# EAGLE design LoRa-E5-Sensor (EAGLE 9.6.2)
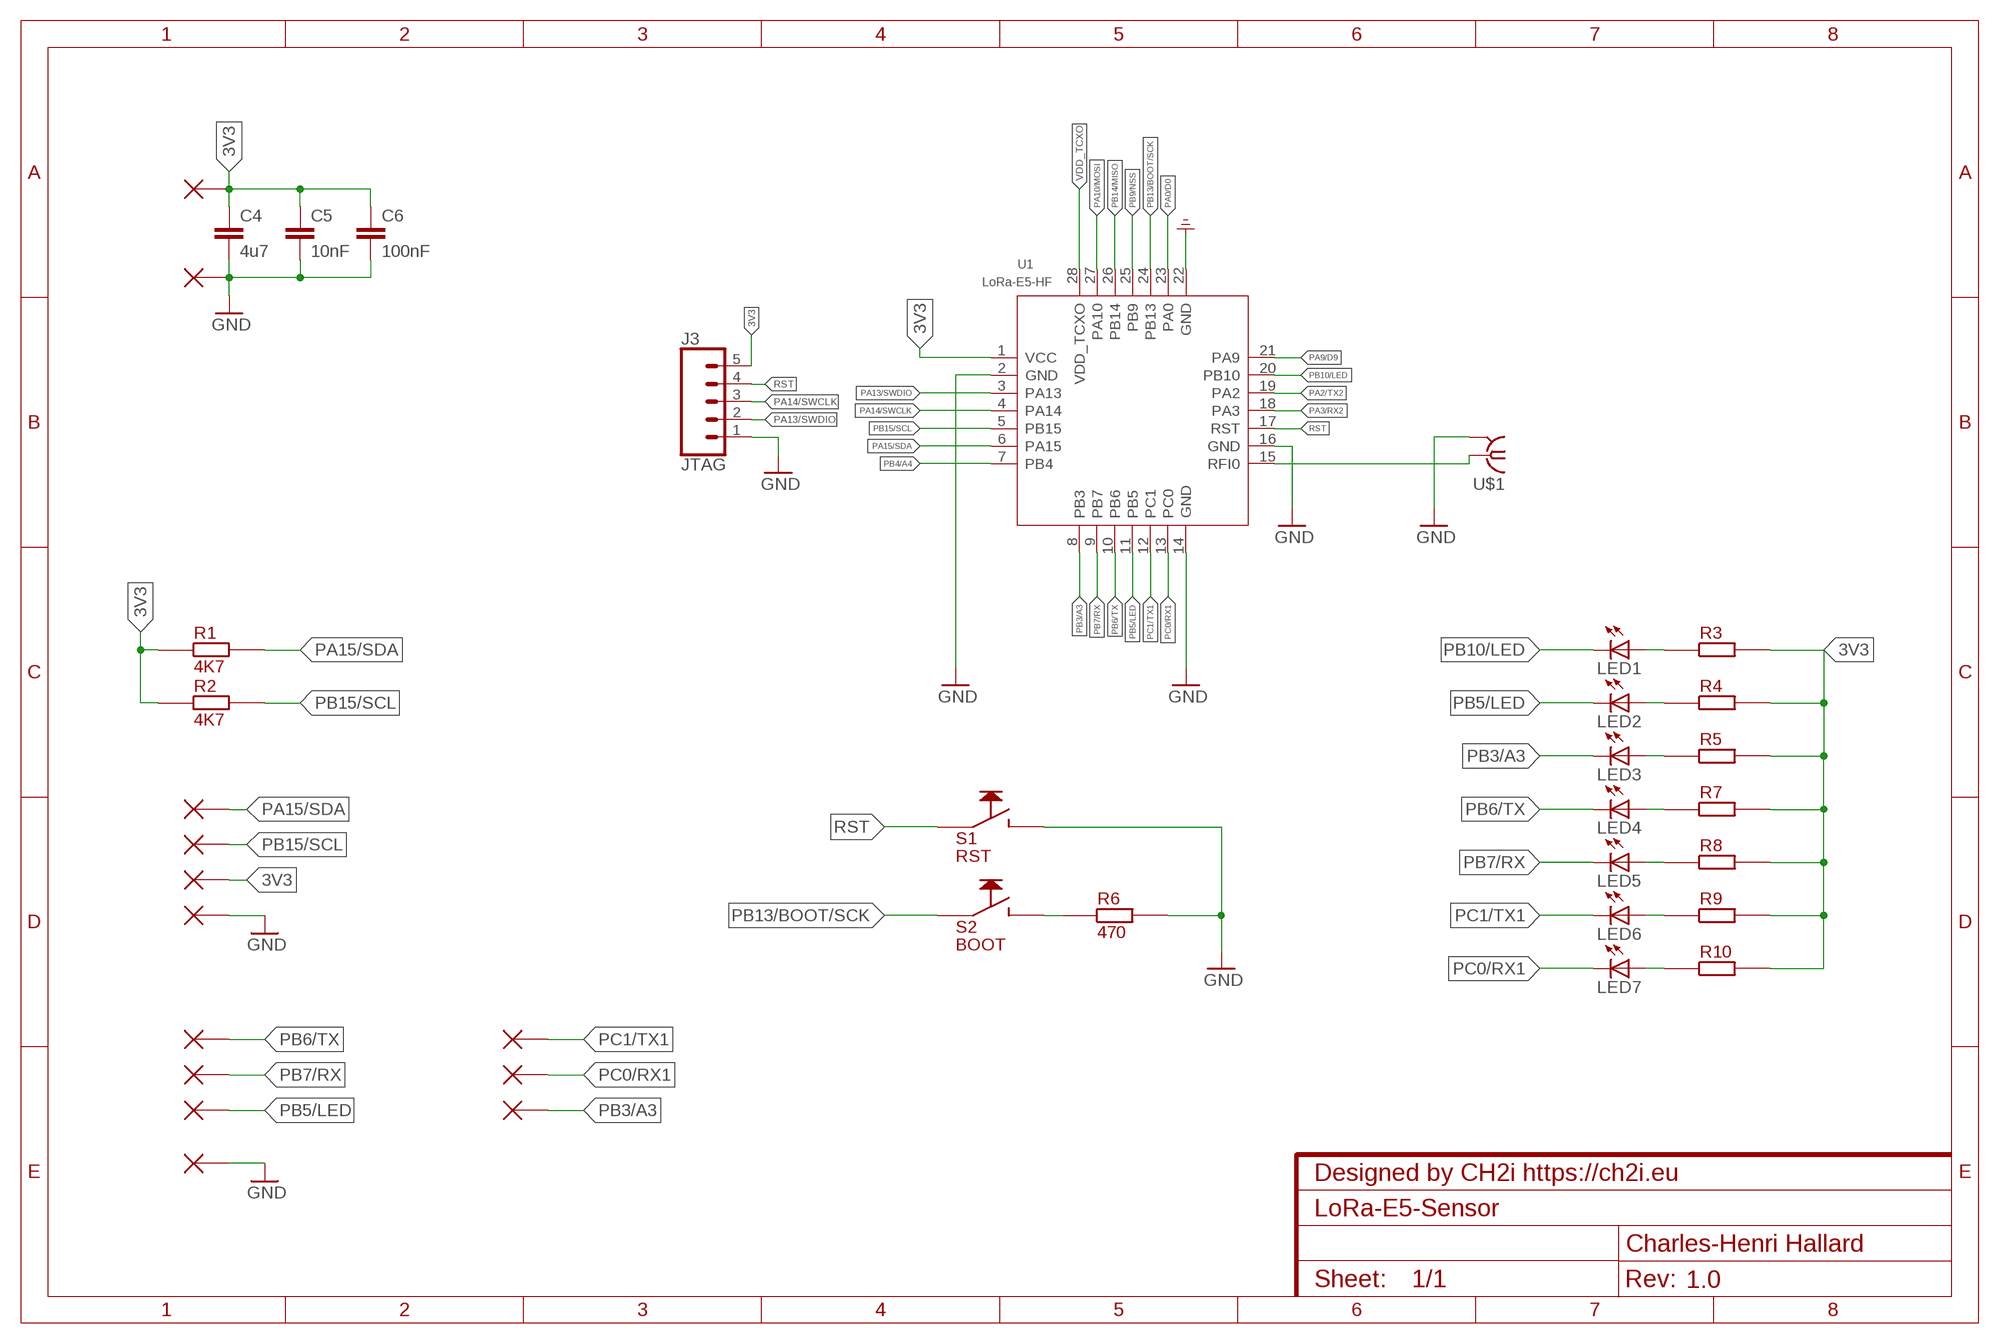
[diagram p0: schematic, sheet 1]
NAME (FRAME-A4L): CNAME: Designed by CH2i https://ch2i.eu; CREVISION: 1.0; DESIGNER: Charles-Henri Hallard

## Parts
C4  4u7  SMD-C-1206  [C1206]
C5  10nF  SMD-C-1206  [C1206]
C6  100nF  SMD-C-1206  [C1206]
J3  JTAG  CONN_05LOCK  [1X05_LOCK]
LED1  SMD-LED-1206  [LED_1206]
LED2  SMD-LED-1206  [LED_1206]
LED3  SMD-LED-1206  [LED_1206]
LED4  SMD-LED-1206  [LED_1206]
LED5  SMD-LED-1206  [LED_1206]
LED6  SMD-LED-1206  [LED_1206]
LED7  SMD-LED-1206  [LED_1206]
P1  PIN  [PIN]
P2  PIN  [PIN]
P3  PIN  [PIN]
P4  PIN  [PIN]
P5  PIN  [PIN]
P6  PIN  [PIN]
P7  PIN  [PIN]
P8  PIN  [PIN]
P9  PIN  [PIN]
P10  PIN  [PIN]
P11  PIN  [PIN]
P12  PIN  [PIN]
P13  PIN  [PIN]
R1  4K7  SMD-RR0603  [R0603]
R2  4K7  SMD-RR0603  [R0603]
R3  SMD-RR0603  [R0603]
R4  SMD-RR0603  [R0603]
R5  SMD-RR0603  [R0603]
R6  470  SMD-RR1206  [C1206]
R7  SMD-RR0603  [R0603]
R8  SMD-RR0603  [R0603]
R9  SMD-RR0603  [R0603]
R10  SMD-RR0603  [R0603]
S1  RST  SMD-PUSH-BUTTONILS-3X6X2,5  [SMD-PUSH-BUTTON-ILS-3X6X2,5]
S2  BOOT  SMD-PUSH-BUTTONILS-3X6X2,5  [SMD-PUSH-BUTTON-ILS-3X6X2,5]
U1  LoRa-E5-HF  MOUDLE_LORA_E5  [MOUDLE28P-1.25-12X12X2.5MM]
U$1  SMAU.FL  [U.FL_SMT]

## Nets
3V3: C4.1 C5.1 C6.1 J3.5 P4.P$1 P5.P$1 R1.1 R2.1 R3.2 R4.2 R5.2 R7.2 R8.2 R9.2 R10.2 U1.1(VCC)
GND: C4.2 C5.2 C6.2 J3.1 P1.P$1 P6.P$1 P9.P$1 R6.2 S1.P$2 U1.2(GND) U1.14(GND) U1.16(GND) U1.22(GND) U$1.GND1(SHIELD) U$1.GND2(SHIELD) ; supply symbol labelled GND_POWER
N$1: R6.1 S2.P$2
N$2: U1.15(RFI0) U$1.SIG(ANT)
N$3: LED1.A R3.1
N$4: LED2.A R4.1
N$5: LED3.A R5.1
N$6: LED4.A R7.1
N$7: LED5.A R8.1
N$8: LED6.A R9.1
N$9: LED7.A R10.1
PA0/D0: U1.23(PA0)
PA2/TX2: U1.19(PA2)
PA3/RX2: U1.18(PA3)
PA9/D9: U1.21(PA9)
PA10/MOSI: U1.27(PA10)
PA13/SWDIO: J3.2 U1.3(PA13)
PA14/SWCLK: J3.3 U1.4(PA14)
PA15/SDA: P2.P$1 R1.2 U1.6(PA15)
PB3/A3: LED3.C P13.P$1 U1.8(PB3)
PB4/A4: U1.7(PB4)
PB5/LED: LED2.C P12.P$1 U1.11(PB5)
PB6/TX: LED4.C P7.P$1 U1.10(PB6)
PB7/RX: LED5.C P8.P$1 U1.9(PB7)
PB9/NSS: U1.25(PB9)
PB10/LED: LED1.C U1.20(PB10)
PB13/BOOT/SCK: S2.P$1 U1.24(PB13)
PB14/MISO: U1.26(PB14)
PB15/SCL: P3.P$1 R2.2 U1.5(PB15)
PC0/RX1: LED7.C P11.P$1 U1.13(PC0)
PC1/TX1: LED6.C P10.P$1 U1.12(PC1)
RST: J3.4 S1.P$1 U1.17(RST)
VDD_TCXO: U1.28(VDD_TCXO)

## Library data of the parts
C4-C6 = Standardbauteile:SMD-C-1206
J3 = SparkFun-Connectors:CONN_05: Multi connection point. Often used as Generic Header-pin footprint for 0.1 inch spaced/style header connections On any of the 0.1 inch spaced packages, you can populate with these: Break Away Headers - Straight <https://www.sparkfun.com/products/116> (PRT-00116) Break Away Male Headers - Right Angle <https://www.sparkfun.com/products/553> (PRT-00553) Female Headers <https://www.sparkfun.com/products/115> (PRT-00115) Break Away Headers - Machine Pin <https://www.sparkfun.com/products/117> (PRT-00117) Break Away Female Headers - Swiss Machine Pin <https://www.sparkfun.com/products/743> (PRT-00743) For SCREWTERMINALS and SPRING TERMINALS visit here: Screw Terimnals on SparkFun.com <https://www.sparkfun.com/search/results?term=Screw+Terminals> (5mm/3.5mm/2.54mm spacing) This device is also useful as a general connection point to wire up your design to another part of your project. Our various solder wires solder well into these plated through hole pads. Hook-Up Wire - Assortment (Stranded, 22 AWG) <https://www.sparkfun.com/products/11375> (PRT-11375) Hook-Up Wire - Assortment (Solid Core, 22 AWG) <https://www.sparkfun.com/products/11367> (PRT-11367) View the entire wire category on our website here <https://www.sparkfun.com/categories/141> Special notes: Molex polarized connector foot print use with SKU : PRT-08231 with associated crimp pins and housings. 1MM SMD Version SKU: PRT-10208
LED1-LED7 = Standardbauteile:SMD-LED-1206
P1-P13 = Mechanik:PIN
R1-R10 = Standardbauteile:SMD-R
S1 S2 = Mechanik:SMD-PUSH-BUTTON
U1 = moudle-new:MOUDLE_LORA_E5
U$1 = Mechanik:SMA

## Board
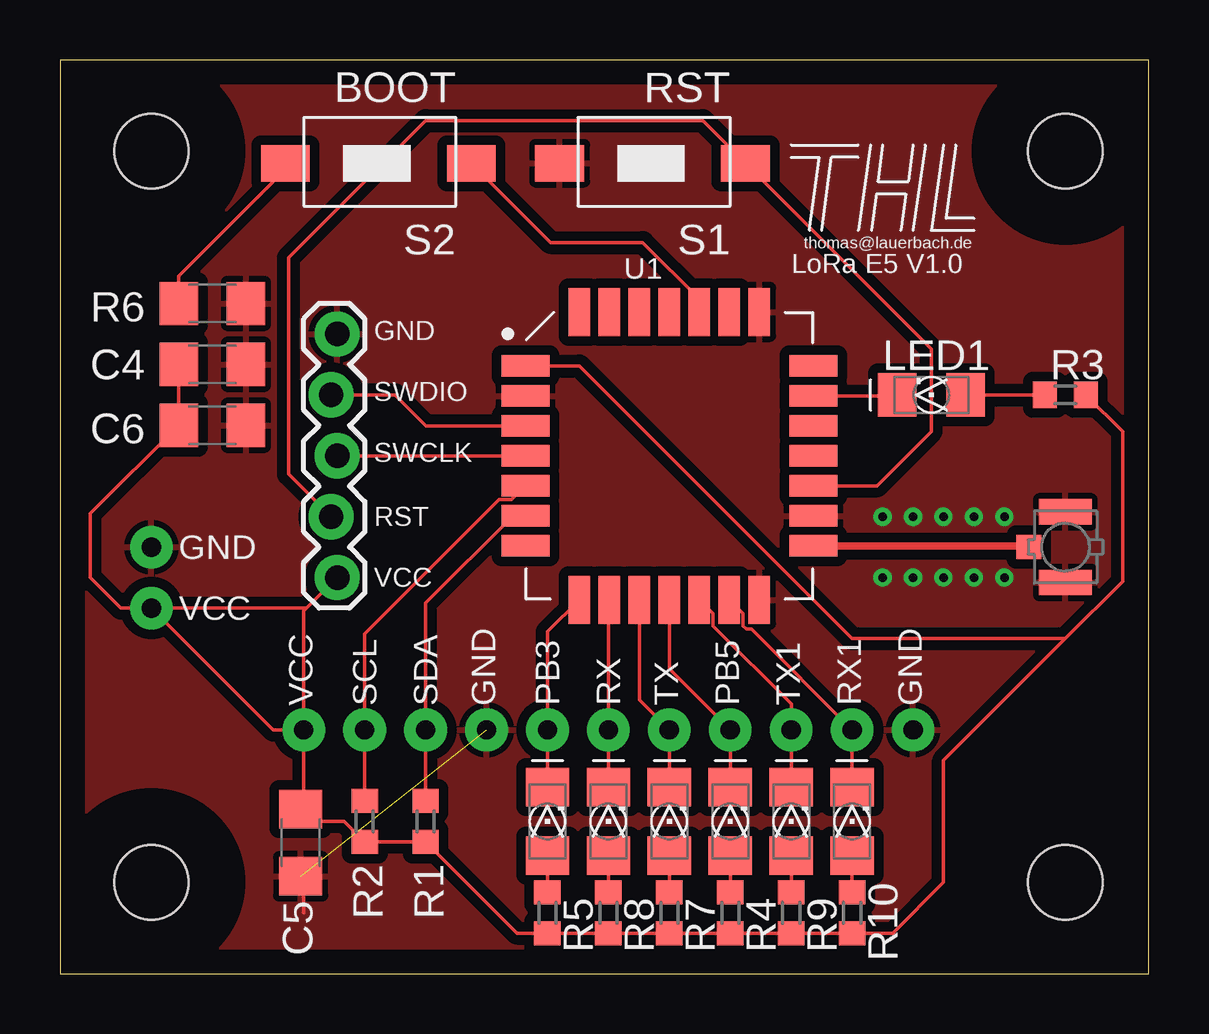
[diagram p1: board, top side]
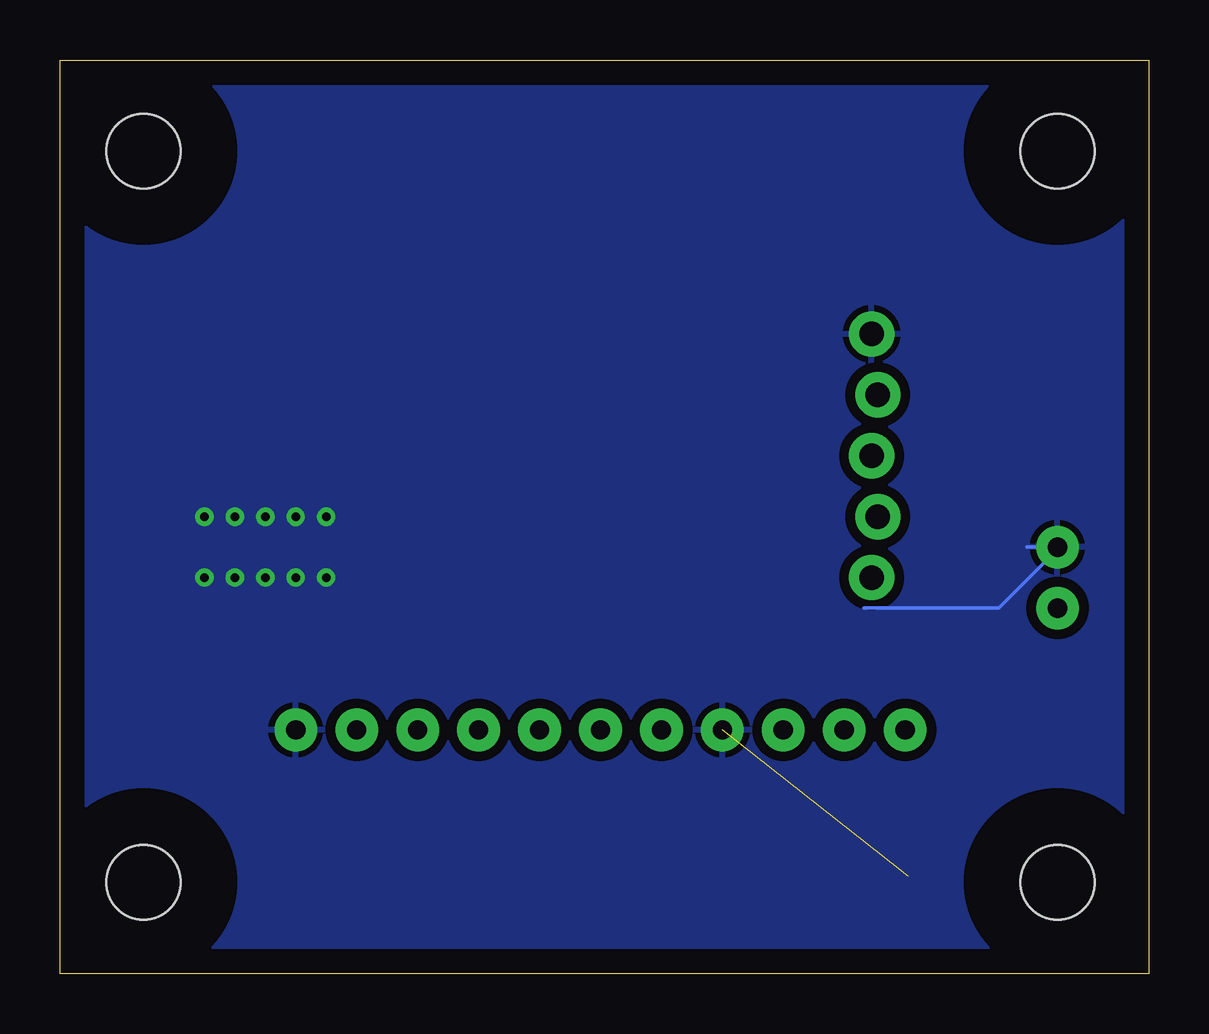
[diagram p2: board, bottom side, seen from below]

Size 45.39 x 38.09 mm. Coordinates in mm from the lower left corner, seen from the top.
Outline: 0,0 45.39,0 45.39,38.09 0,38.09 0,0
Copper layers (1*16): Top 0.035mm / dielectric 1.5mm / Bottom 0.035mm
Design rules "default": minimum track width 6mil, minimum drill 0.35mm, track to track 6mil, track to pad 6mil, pad to pad 6mil, via to via 6mil, smd to smd 6mil, copper to edge 40mil, drill to drill 6mil, minimum pad ring 10mil, minimum via ring 8mil, stop-mask expansion 4mil, vias tented up to drill 0mil, thermal gap 10mil

### Footprints (pad centres in the part's own frame; a part is rotated, then mirrored left to right if it is on the bottom)
C1206 = smd 1.6 x 1.8: 1 -1.4,0; 2 1.4,0
1X05_LOCK = drill 1.016 pad 1.88: 1 0,0.127; 2 2.54,-0.127; 3 5.08,0.127; 4 7.62,-0.127; 5 10.16,0.127
LED_1206 = smd 1.6 x 1.803: A -1.422,0; C 1.422,0
PIN = drill 0.8 pad 1.778: P$1 0,0
R0603 = smd 1 x 1.1: 1 -0.85,0; 2 0.85,0
SMD-PUSH-BUTTON-ILS-3X6X2,5 = smd 2.032 x 1.524: P$1 -4.445,0; P$2 3.302,0
MOUDLE28P-1.25-12X12X2.5MM = smd 2 x 0.9: 1 -6,3.75; 2 -6,2.5; 3 -6,1.25; 4 -6,0; 5 -6,-1.25; 6 -6,-2.5; 7 -6,-3.75; 15 6,-3.75; 16 6,-2.5; 17 6,-1.25; 18 6,0; 19 6,1.25; 20 6,2.5; 21 6,3.75 | smd 0.9 x 2: 8 -3.75,-6; 9 -2.5,-6; 10 -1.25,-6; 11 0,-6; 12 1.25,-6; 13 2.5,-6; 14 3.75,-6; 22 3.75,6; 23 2.5,6; 24 1.25,6; 25 0,6; 26 -1.25,6; 27 -2.5,6; 28 -3.75,6
U.FL_SMT = smd 1.05 x 2.2: GND1 -1.475,0; GND2 1.475,0 | smd 1 x 1.05: SIG 0,-1.525
BOHRUNG_3MM_UNTERLEGSCHEIBE = hole 3.1: 0,0

### Placement (x,y rotation side)
C4  6.35,25.4 0 top
C5  10.03,5.46 270 top
C6  6.35,22.86 0 top
J3  11.43,26.67 270 top
LED1  36.32,24.13 180 top
LED2  27.94,6.35 90 top
LED3  20.32,6.35 90 top
LED4  25.4,6.35 90 top
LED5  22.86,6.35 90 top
LED6  30.48,6.35 90 top
LED7  33.02,6.35 90 top
P1  3.81,17.78 0 top
P2  15.24,10.16 0 top
P3  12.7,10.16 0 top
P4  10.16,10.16 0 top
P5  3.81,15.24 0 top
P6  17.78,10.16 0 top
P7  25.4,10.16 0 top
P8  22.86,10.16 0 top
P9  35.56,10.16 0 top
P10  30.48,10.16 0 top
P11  33.02,10.16 0 top
P12  27.94,10.16 0 top
P13  20.32,10.16 0 top
R1  15.24,6.35 90 top
R2  12.7,6.35 90 top
R3  41.91,24.13 0 top
R4  27.94,2.54 270 top
R5  20.32,2.54 270 top
R6  6.35,27.94 0 top
R7  25.4,2.54 270 top
R8  22.86,2.54 270 top
R9  30.48,2.54 270 top
R10  33.02,2.54 270 top
S1  24.13,33.78 180 top
S2  12.7,33.78 180 top
U1  25.4,21.59 0 top
U$1  41.91,17.78 270 top
U$2  [BOHRUNG_3MM_UNTERLEGSCHEIBE]  3.81,34.29 0 top
U$3  [BOHRUNG_3MM_UNTERLEGSCHEIBE]  3.81,3.81 0 top
U$4  [BOHRUNG_3MM_UNTERLEGSCHEIBE]  41.91,3.81 0 top
U$5  [BOHRUNG_3MM_UNTERLEGSCHEIBE]  41.91,34.29 0 top
U$6  [THL-SMALL]  34.29,33.02 0 top

### Tracks (layer width: path | path; a pad name or v marks a point on that pad's centre or on a via)
3V3
  Top 0.152: P4.P$1 10.16,6.99 C5.1 10.54,6.35 11.85,6.35 R2.1 R1.1 19.05,1.69 R5.2 R8.2 R7.2 R4.2 R9.2 R10.2 34.71,1.69 36.83,3.81 36.83,8.89 41.91,13.97 | P5.P$1 10.29,15.24 J3.5 10.16,15.11 P4.P$1 | P5.P$1 2.54,15.24 1.27,16.51 1.27,19.18 C6.1 C4.1 | U1.1 21.65,25.34 33.02,13.97 41.91,13.97 | 41.91,13.97 44.3,16.36 44.3,22.59 R3.2 | P4.P$1 8.89,10.16 P5.P$1
GND  (via drill 0.35)  (1 unrouted)
  Top 0.152: C5.2 10.16,3.93 10.16,2.54
  Bottom 0.152: 11.89,15.24 6.25,15.24 3.81,17.68 P1.P$1 5.08,17.78
  other vias: 34.29,19.05 35.56,19.05 36.83,19.05 38.1,19.05 39.37,19.05 34.29,16.51 35.56,16.51 36.83,16.51 38.1,16.51 39.37,16.51
  pour Top (isolate 0.406): 0,0 46.99,0 46.99,38.1 0,38.1
  pour Bottom (isolate 0.406): 0,38.1 0,0 45.72,0 45.72,39.37 0,39.37
N$1
  Top 0.152: R6.1 4.95,29.08 9.4,33.53 S2.P$2
N$2
  Top 0.152: 40.33,17.84 U$1.SIG
  Top 0.305: U1.15 40.33,17.84
N$3
  Top 0.152: LED1.A R3.1
N$4
  Top 0.152: LED2.A R4.1
N$5
  Top 0.152: LED3.A R5.1
N$6
  Top 0.152: LED4.A R7.1
N$7
  Top 0.152: LED5.A R8.1
N$8
  Top 0.152: LED6.A R9.1
N$9
  Top 0.152: LED7.A R10.1
PA13/SWDIO
  Top 0.152: U1.3 15.26,22.84 13.97,24.13 J3.2
PA14/SWCLK
  Top 0.152: U1.4 J3.3
PA15/SDA
  Top 0.152: R1.2 P2.P$1 15.24,15.45 18.88,19.09 U1.6
PB3/A3
  Top 0.152: U1.8 20.32,14.26 P13.P$1 LED3.C
PB5/LED
  Top 0.152: U1.11 25.4,12.7 P12.P$1 LED2.C
PB6/TX
  Top 0.152: U1.10 24.15,11.41 P7.P$1 LED4.C
PB7/RX
  Top 0.152: U1.9 22.86,15.55 P8.P$1 LED5.C
PB10/LED
  Top 0.152: U1.20 34.86,24.09 LED1.C
PB13/BOOT/SCK
  Top 0.152: S2.P$1 20.45,30.48 24.28,30.48 26.65,28.11 U1.24
PB15/SCL
  Top 0.152: R2.2 P3.P$1 12.7,14.16 18.3,19.77 18.83,19.77 U1.5
PC0/RX1
  Top 0.152: U1.13 28.47,15.02 28.47,14.49 28.61,14.36 28.82,14.36 P11.P$1 LED7.C
PC1/TX1
  Top 0.152: U1.12 27.22,15.02 27.22,14.49 30.48,11.24 P10.P$1 LED6.C
RST
  Top 0.152: U1.17 34.06,20.34 36.32,22.61 36.32,26.04 S1.P$1 26.8,35.56 15.24,35.56 9.53,29.84 9.53,20.83 J3.4

### Text on the board
tNames: LoRa E5 V1.0 | GND | SWDIO | SWCLK | RST | GND | VCC | VCC | VCC | SCL | SDA | GND | PB3 | RX | TX | PB5 | TX1 | RX1 | GND